# Altium schematic sheet Accumulator_MGMT.SchDoc
size A4
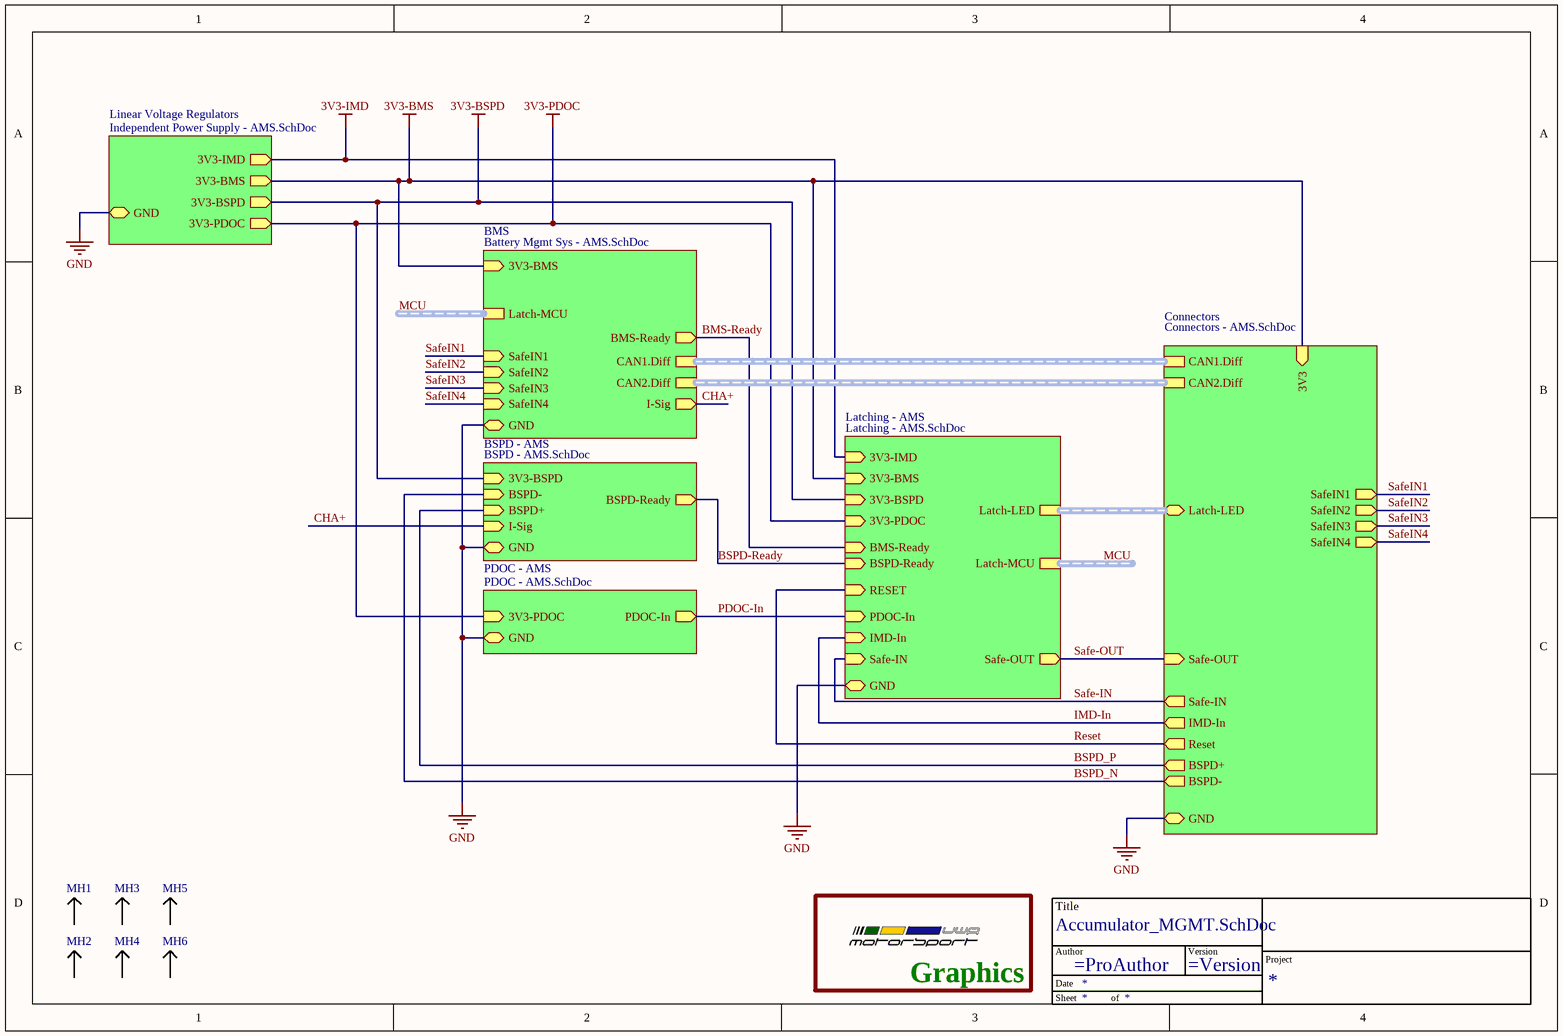
[diagram p0: Accumulator_MGMT.SchDoc]

## Parts
*  TitleBlock  (value not drawn)  (graphical)
Graphic  UWAM Logo  [UWAM Logo]  (value not drawn)  (graphical)
MH1  M3 Mounting Hole  [M3 MH]  (value not drawn)  (no BOM)
MH2  M3 Mounting Hole  [M3 MH]  (value not drawn)  (no BOM)
MH3  M3 Mounting Hole  [M3 MH]  (value not drawn)  (no BOM)
MH4  M3 Mounting Hole  [M3 MH]  (value not drawn)  (no BOM)
MH5  M3 Mounting Hole  [M3 MH]  (value not drawn)  (no BOM)
MH6  M3 Mounting Hole  [M3 MH]  (value not drawn)  (no BOM)

## Blocks framed on the sheet
Graphics: Graphic

## Sub-sheets
BMS = Battery Mgmt Sys - AMS.SchDoc: BMS-Ready (out), 3V3-BMS (in), CAN1.Diff (harness CANDiff), CAN2.Diff (harness CANDiff), GND (bidir), I-Sig (out), SafeIN1 (in), SafeIN2 (in), SafeIN3 (in), SafeIN4 (in), Latch-MCU (harness Latch-MCU)
BSPD - AMS = BSPD - AMS.SchDoc: BSPD-Ready (out), 3V3-BSPD (in), BSPD- (in), BSPD+ (in), GND (bidir), I-Sig (in)
Connectors = Connectors - AMS.SchDoc: CAN1.Diff (harness CANDiff), CAN2.Diff (harness CANDiff), Safe-OUT (in), BSPD+ (out), Reset (out), Safe-IN (out), IMD-In (out), 3V3 (in), BSPD- (out), SafeIN1 (out), SafeIN2 (out), SafeIN3 (out), SafeIN4 (out), GND (bidir), Latch-LED (bidir, harness Latch-LED)
Latching - AMS = Latching - AMS.SchDoc: 3V3-IMD (in), 3V3-BMS (in), 3V3-BSPD (in), 3V3-PDOC (in), BSPD-Ready (in), BMS-Ready (in), PDOC-In (in), IMD-In (in), Safe-OUT (out), Safe-IN (in), RESET (in), GND (bidir), Latch-MCU (harness Latch-MCU), Latch-LED (harness Latch-LED)
Linear Voltage Regulators = Independent Power Supply - AMS.SchDoc: 3V3-IMD (out), 3V3-BMS (out), 3V3-BSPD (out), 3V3-PDOC (out), GND (bidir)
PDOC - AMS = PDOC - AMS.SchDoc: PDOC-In (out), 3V3-PDOC (in), GND (bidir)

## Nets
3V3-BMS: sheet BMS/3V3-BMS, sheet Latching - AMS/3V3-BMS, sheet Linear Voltage Regulators/3V3-BMS, sheet Connectors/3V3
3V3-BSPD: sheet BSPD - AMS/3V3-BSPD, sheet Latching - AMS/3V3-BSPD, sheet Linear Voltage Regulators/3V3-BSPD
3V3-IMD: sheet Latching - AMS/3V3-IMD, sheet Linear Voltage Regulators/3V3-IMD
3V3-PDOC: sheet Latching - AMS/3V3-PDOC, sheet PDOC - AMS/3V3-PDOC, sheet Linear Voltage Regulators/3V3-PDOC
GND: sheet BMS/GND, sheet BSPD - AMS/GND, sheet Latching - AMS/GND, sheet PDOC - AMS/GND, sheet Linear Voltage Regulators/GND, sheet Connectors/GND
BMS-Ready: sheet BMS/BMS-Ready, sheet Latching - AMS/BMS-Ready
BSPD-Ready: sheet BSPD - AMS/BSPD-Ready, sheet Latching - AMS/BSPD-Ready
BSPD_N: sheet BSPD - AMS/BSPD-, sheet Connectors/BSPD-
BSPD_P: sheet BSPD - AMS/BSPD+, sheet Connectors/BSPD+
CHA+: sheet BMS/I-Sig, sheet BSPD - AMS/I-Sig
IMD-In: sheet Latching - AMS/IMD-In, sheet Connectors/IMD-In
PDOC-In: sheet Latching - AMS/PDOC-In, sheet PDOC - AMS/PDOC-In
Reset: sheet Latching - AMS/RESET, sheet Connectors/Reset
Safe-IN: sheet Latching - AMS/Safe-IN, sheet Connectors/Safe-IN
Safe-OUT: sheet Latching - AMS/Safe-OUT, sheet Connectors/Safe-OUT
SafeIN1: sheet BMS/SafeIN1, sheet Connectors/SafeIN1
SafeIN2: sheet BMS/SafeIN2, sheet Connectors/SafeIN2
SafeIN3: sheet BMS/SafeIN3, sheet Connectors/SafeIN3
SafeIN4: sheet BMS/SafeIN4, sheet Connectors/SafeIN4

Not connected (* = marked no-connect by the designer): MH1 1; MH2 1; MH3 1; MH4 1; MH5 1; MH6 1

## Buses and harness runs
harness MCU = sheet BMS/Latch-MCU
harness MCU = sheet Latching - AMS/Latch-MCU
harness sheet BMS/CAN1.Diff = sheet Connectors/CAN1.Diff
harness sheet BMS/CAN2.Diff = sheet Connectors/CAN2.Diff
harness sheet Connectors/Latch-LED = sheet Latching - AMS/Latch-LED

## Notes on the sheet
- (in symbol TitleBlock) Title; Author; Version; Project; Date; Sheet; of